# EasyEDA schematic EasyEDA_SCH_BL28Z-3005ZSK04Y(K Version) Bargraph Version to HT16K33 Driver PCB_2023-11-28.json
TITLE: Wand Bargraph (K Version) and HT16K33 Driver; REV: 0.2; Date: 2023-11-28; Sheet: 1/1; Drawn By: r_balboa8
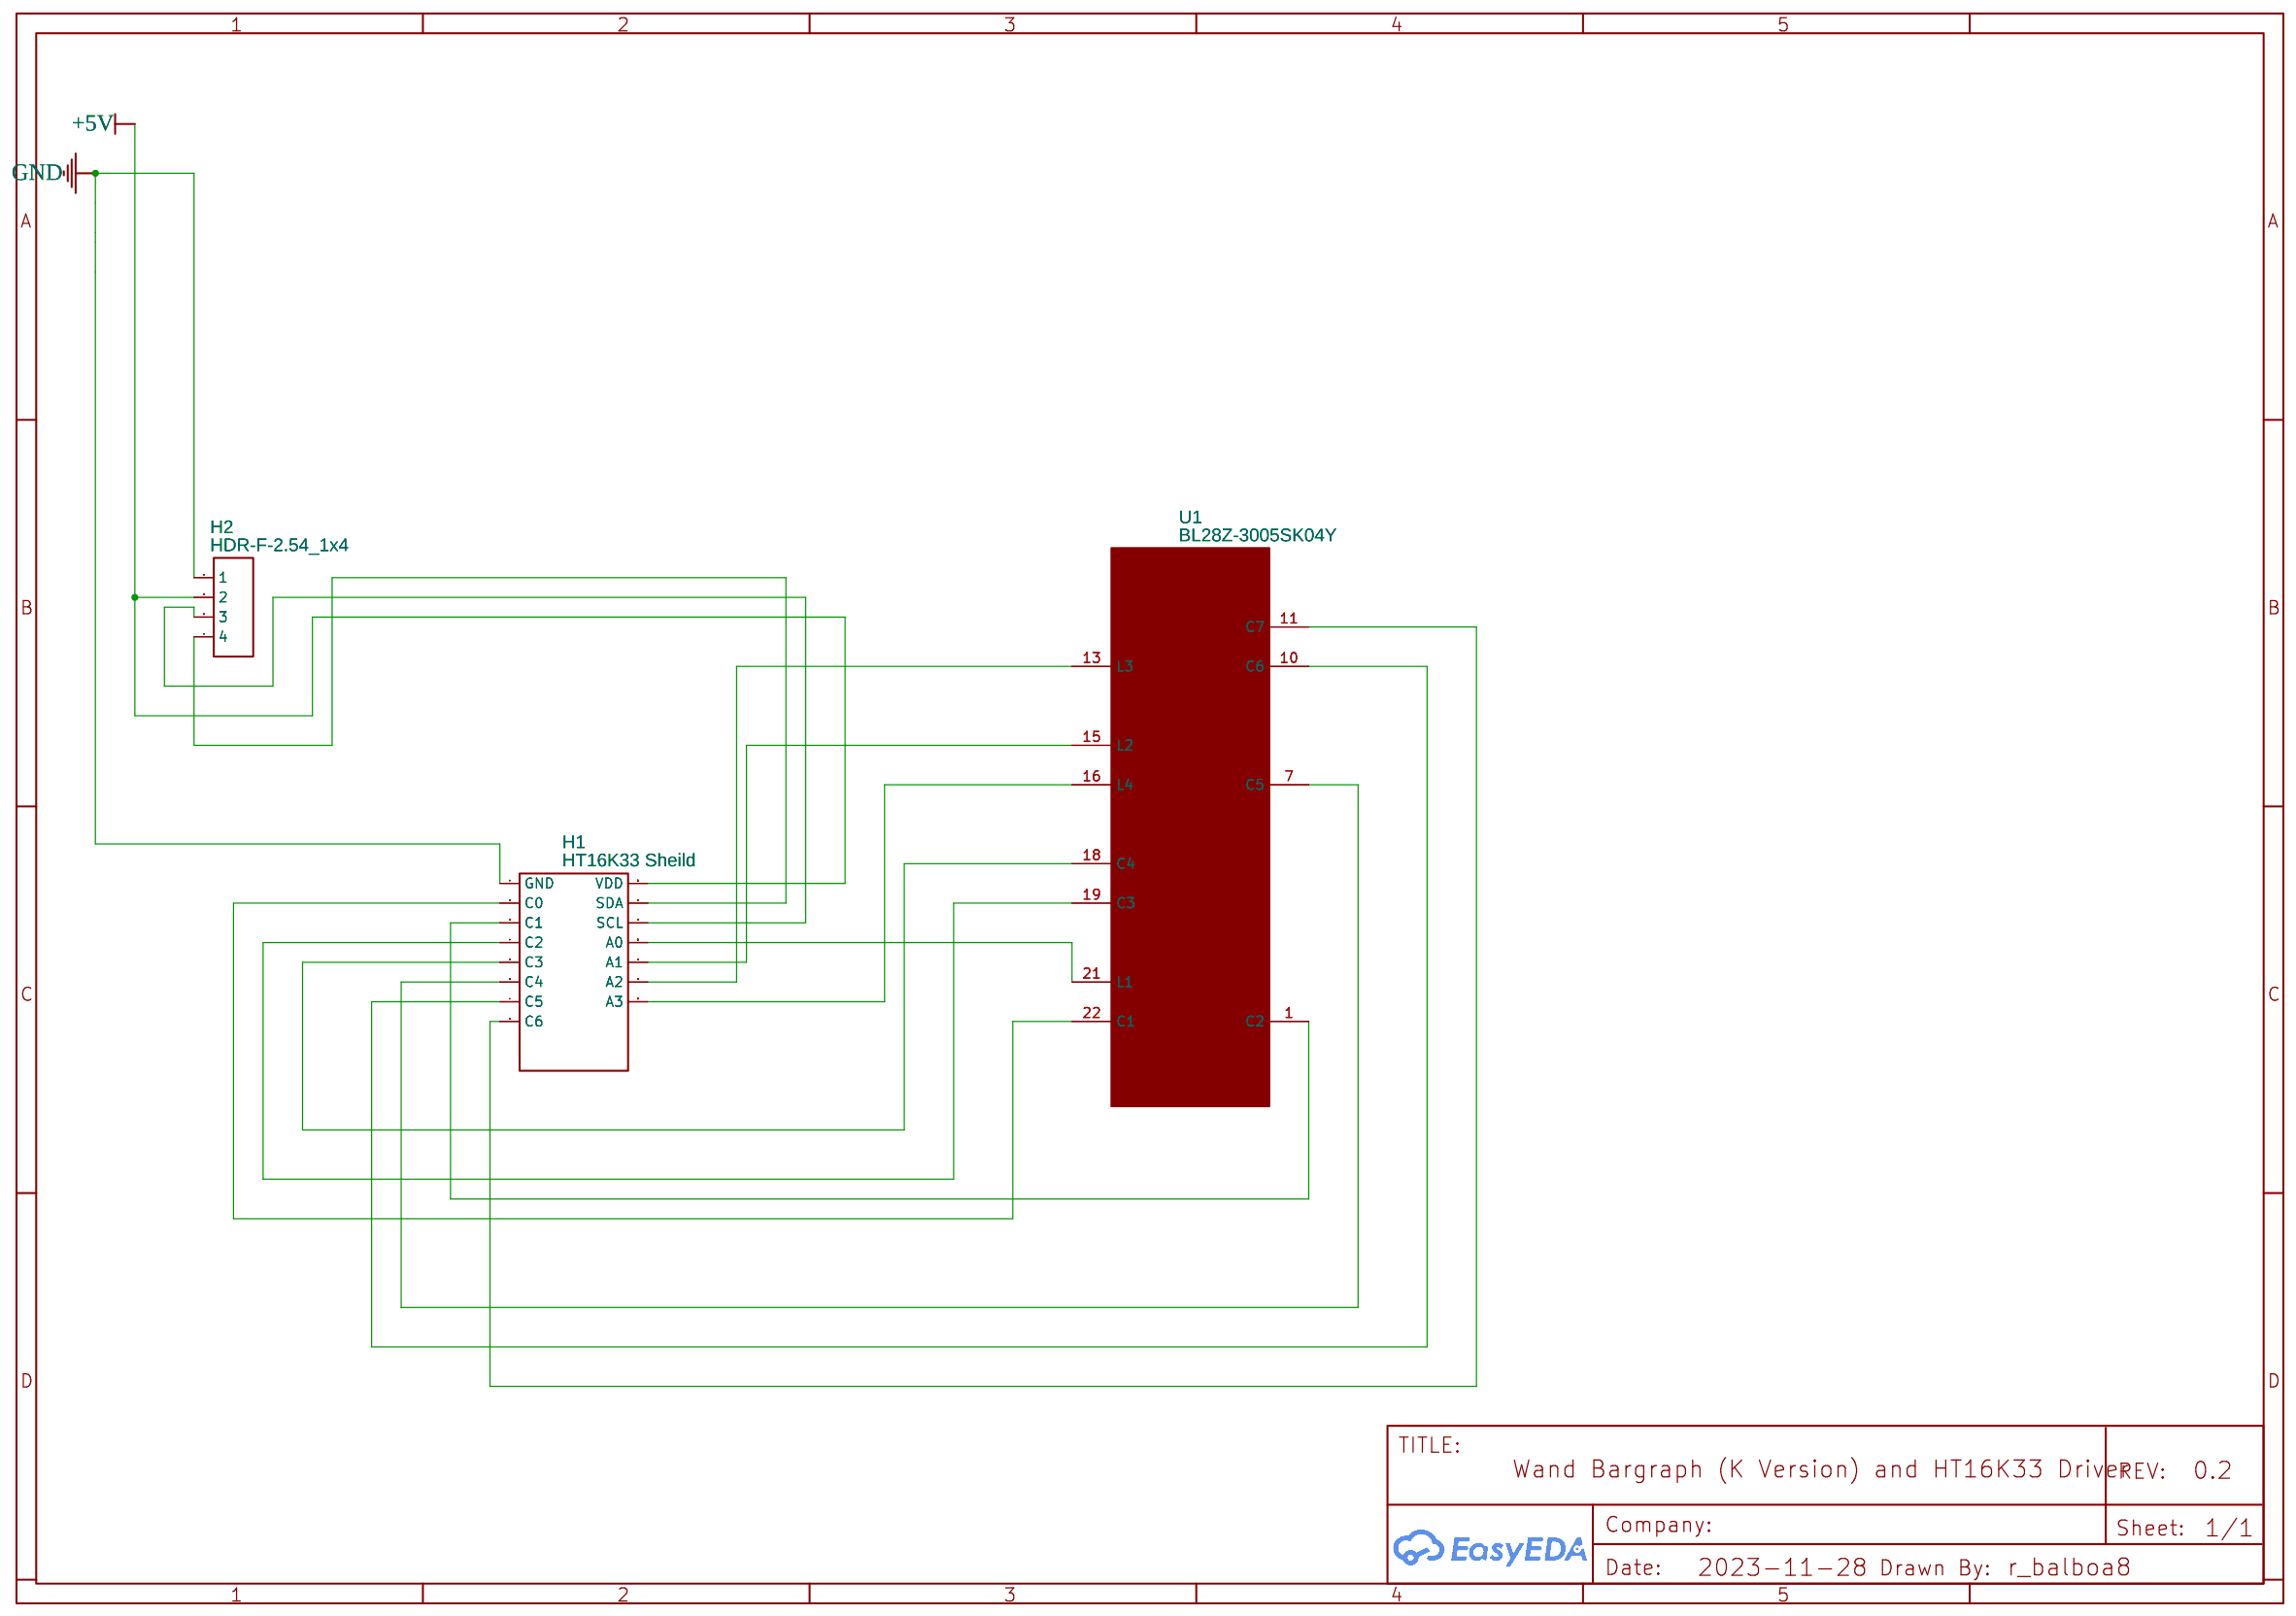
[diagram p0: schematic sheet]

## Parts
H1  HT16K33 Sheild  [HT16K33 BL28Z (COMMON CATHODE)]
H2  HDR-F-2.54_1x4  [HDR-F-2.54_1X4]
U1  BL28Z-3005SK04Y  [BARMETER BL]

## Library data of the parts
H1 = HT16K33 BL28Z (Common Cathode): Supplier Part: C225505; Supplier: LCSC; Contributor: r_balboa8; Convert to PCB: Yes; Add into BOM: Yes
H2 = HDR-F-2.54_1x4: Supplier Part: C225501; Supplier: LCSC; Contributor: LCEDA_Lib
U1 = BL28Z-3005SA04Y: Manufacturer: BARMETER; Manufacturer Part: BL28-3005SDK04; link: http://www.barmeter.com/en/viewproduct.asp?ID=184&XiajiID=0; Contributor: lucalcin

## Nets
+5V: H1.28(VDD) H2.2
GND: H1.1(GND) H2.1
Net-(H1-2): H1.2(C0) U1.22(C1)
Net-(H1-3): H1.3(C1) U1.1(C2)
Net-(H1-4): H1.4(C2) U1.19(C3)
Net-(H1-5): H1.5(C3) U1.18(C4)
Net-(H1-6): H1.6(C4) U1.7(C5)
Net-(H1-7): H1.7(C5) U1.10(C6)
Net-(H1-8): H1.8(C6) U1.11(C7)
Net-(H1-22): H1.22(A3) U1.16(L4)
Net-(H1-23): H1.23(A2) U1.13(L3)
Net-(H1-24): H1.24(A1) U1.15(L2)
Net-(H1-25): H1.25(A0) U1.21(L1)
Net-(H1-26): H1.26(SCL) H2.3
Net-(H1-27): H1.27(SDA) H2.4
